# Altium schematic sheet 24V Regulators.SchDoc
size A3
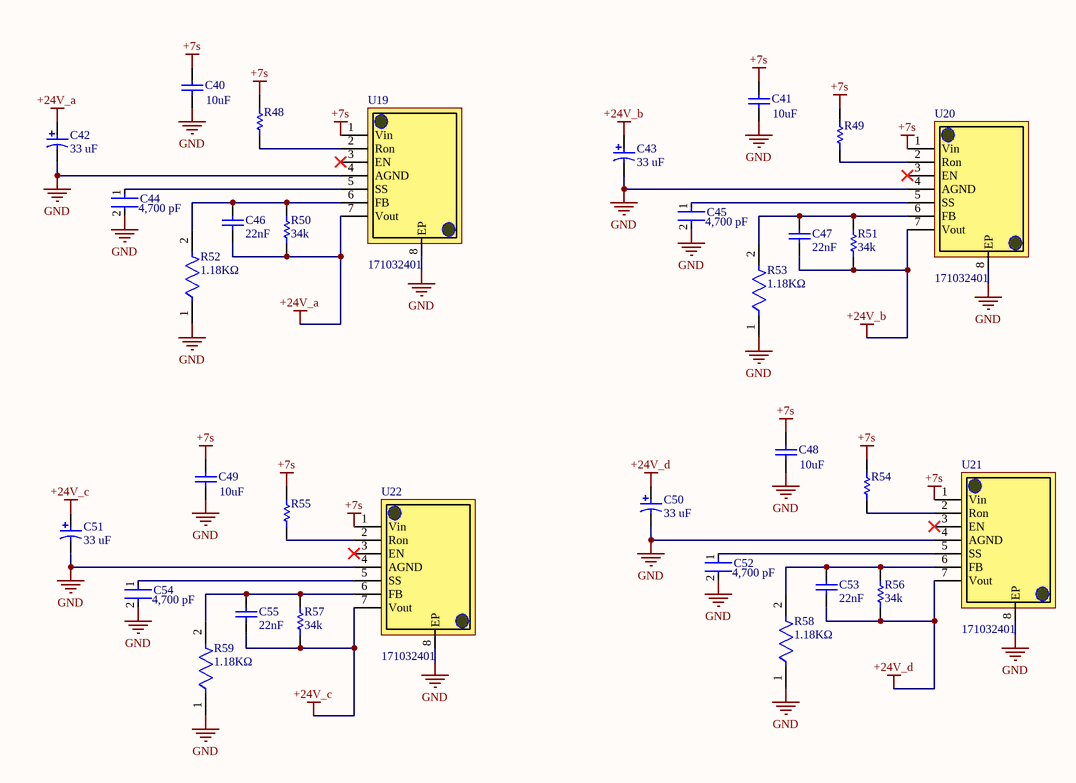
[diagram p0: 24V Regulators.SchDoc]

## Parts
C40  value 10uF  [C1206]  (hidden comment: Cap Semi)
C41  value 10uF  [C1206]  (hidden comment: Cap Semi)
C42  Rated Capacitance: 33 uF  [NIC-CAPA2-6.3X5.8_V]  (hidden comment: UUD1V330MCL1GS)
C43  Rated Capacitance: 33 uF  [NIC-CAPA2-6.3X5.8_V]  (hidden comment: UUD1V330MCL1GS)
C44  Capacitance: 4,700 pF  [FP-C0805C-DN-MFG]  (hidden comment: C0805C472K5RACTU)
C45  Capacitance: 4,700 pF  [FP-C0805C-DN-MFG]  (hidden comment: C0805C472K5RACTU)
C46  22nF  [CAPC2013X145X50NL20T25]
C47  22nF  [CAPC2013X145X50NL20T25]
C48  value 10uF  [C1206]  (hidden comment: Cap Semi)
C49  value 10uF  [C1206]  (hidden comment: Cap Semi)
C50  Rated Capacitance: 33 uF  [NIC-CAPA2-6.3X5.8_V]  (hidden comment: UUD1V330MCL1GS)
C51  Rated Capacitance: 33 uF  [NIC-CAPA2-6.3X5.8_V]  (hidden comment: UUD1V330MCL1GS)
C52  Capacitance: 4,700 pF  [FP-C0805C-DN-MFG]  (hidden comment: C0805C472K5RACTU)
C53  22nF  [CAPC2013X145X50NL20T25]
C54  Capacitance: 4,700 pF  [FP-C0805C-DN-MFG]  (hidden comment: C0805C472K5RACTU)
C55  22nF  [CAPC2013X145X50NL20T25]
R48  RC0805FR-07499KL  [RESC2013X60X35LL10T20]  (value not drawn)
R49  RC0805FR-07499KL  [RESC2013X60X35LL10T20]  (value not drawn)
R50  value 34k  [RESC2013X60X40ML20T25]  (hidden comment: ERA6AEB3402V)
R51  value 34k  [RESC2013X60X40ML20T25]  (hidden comment: ERA6AEB3402V)
R52  value 1.18KΩ  [FP-RT0805-MFG]  (hidden comment: RT0805BRE071K18L)
R53  value 1.18KΩ  [FP-RT0805-MFG]  (hidden comment: RT0805BRE071K18L)
R54  RC0805FR-07499KL  [RESC2013X60X35LL10T20]  (value not drawn)
R55  RC0805FR-07499KL  [RESC2013X60X35LL10T20]  (value not drawn)
R56  value 34k  [RESC2013X60X40ML20T25]  (hidden comment: ERA6AEB3402V)
R57  value 34k  [RESC2013X60X40ML20T25]  (hidden comment: ERA6AEB3402V)
R58  value 1.18KΩ  [FP-RT0805-MFG]  (hidden comment: RT0805BRE071K18L)
R59  value 1.18KΩ  [FP-RT0805-MFG]  (hidden comment: RT0805BRE071K18L)
U19  171032401  [7 PIN PFM]
U20  171032401  [7 PIN PFM]
U21  171032401  [7 PIN PFM]
U22  171032401  [7 PIN PFM]

## Nets
+7s: C40.1 C41.1 C48.1 C49.1 R48.1 R49.1 R54.1 R55.1 U19.1(Vin) U20.1(Vin) U21.1(Vin) U22.1(Vin)
+24V_a: C42.1 C46.1 R50.1 U19.7(Vout)
+24V_b: C43.1 C47.1 R51.1 U20.7(Vout)
+24V_c: C51.1 C55.1 R57.1 U22.7(Vout)
+24V_d: C50.1 C53.1 R56.1 U21.7(Vout)
GND: C40.2 C41.2 C42.2 C43.2 C44.2 C45.2 C48.2 C49.2 C50.2 C51.2 C52.2 C54.2 R52.1 R53.1 R58.1 R59.1 U19.4(AGND) U19.8(EP) U20.4(AGND) U20.8(EP) U21.4(AGND) U21.8(EP) U22.4(AGND) U22.8(EP)
NetC44_1: C44.1 U19.5(SS)
NetC45_1: C45.1 U20.5(SS)
NetC46_2: C46.2 R50.2 R52.2 U19.6(FB)
NetC47_2: C47.2 R51.2 R53.2 U20.6(FB)
NetC52_1: C52.1 U21.5(SS)
NetC53_2: C53.2 R56.2 R58.2 U21.6(FB)
NetC54_1: C54.1 U22.5(SS)
NetC55_2: C55.2 R57.2 R59.2 U22.6(FB)
NetR48_2: R48.2 U19.2(Ron)
NetR49_2: R49.2 U20.2(Ron)
NetR54_2: R54.2 U21.2(Ron)
NetR55_2: R55.2 U22.2(Ron)

Not connected (* = marked no-connect by the designer): U19 3(EN)*; U20 3(EN)*; U21 3(EN)*; U22 3(EN)*

## Library data of the parts
C40 C41 C48 C49 = Cap Semi: Capacitor (Semiconductor SIM Model); Published: 8-Jun-2000; LatestRevisionDate: 29-May-2009; LatestRevisionNote: IPC-7351 Footprint Added.; PackageReference: C1206; Publisher: Altium Limited; PackageDescription: Chip Capacitor; Supplier 1: Avnet; Supplier Part Number 1: CL31A106MBHNNNE
C42 C43 C50 C51 = CMP-0687-00044-1: Aluminum Electrolytic Capacitor, UD Series, Low Impedance, 33 uF, 35 V, + / - 20%, -55 to 105 degC, Chip Type, 6.3 x 5.8 mm D x L, Pb-Free, Reel; Manufacturer: Nichicon; Rated Ripple Current (at 100kHz): 230 mA; Endurance Time: 2000 h; Packing: Dia382mm Reel; Tolerance Rated Capacitance: -20 to 20%; Impedance: 0.44 Ohm; Rated Voltage: 35 V; RoHS: TRUE; PackageReference: CAPAE-D6.3H5.8; PartNumber: UUD1V330MCL1GS; ComponentLink3Description: Package Specification; Diameter: 6.3 mm; PackageDescription: 2-Pin Surface Mount Device, Diameter 6.3 mm, Height 5.8 mm, Pitch 5.4 mm; ComponentLink1URL: http://www.nichicon.co.jp/; Length: 5.8 mm; ComponentLink1Description: Manufacturer URL; ComponentLink2URL: http://products.nichicon.co.jp/en/pdf/XJA043/e-ud.pdf; ComponentLink3URL: http://products.nichicon.co.jp/en/pdf/XJA043/e-ud.pdf; ComponentLink2Description: Datasheet; Mounting Technology: Surface Mount; DatasheetVersion: 08/2012
C44 C45 C52 C54 = CMP-03020-025139-1: CAP CER 4700PF 50V X7R 0805; Manufacturer: KEMET; Value: 4,700 pF; Material: Ceramic; Tolerance: 0.1; Temperature Coefficient: 30ppm/°C; Temperature Characteristic: X7R; Manufacturer Part Number: C0805C472K5RACTU; Temperature Range Low: -55°C; Device Class L1: Passive Components; Lead Free: Yes; Category: Cap; ComponentLink2Description: Datasheet; ComponentLink2URL: https://content.kemet.com/datasheets/KEM_C1003_C0G_SMD.pdf; Device Class L3: Ceramic Capacitors; Digikey Description: CAP CER 4700PF 50V X7R 0805; RoHS: TRUE; Temperature Range High: +125°C; Voltage Rating: 50 V; Mouser Description: Cap Ceramic 0.0047uF 50V X7R 10% SMD 0805 125°C Paper T/R; Octopart: https://octopart.com/c0805c472k5ractu-kemet-86501; Automotive: No; Package: C0805C-DN; Height: 0.88mm; Device Class L2: Capacitors; Temperature: -55°C to +125°C; Ipc Land Pattern Name: CAPC200125X78
C46 C47 C53 C55 = CMP-2007-01055-1: Part Number: C0805C223K1RACAUTO; Manufacturer: Kemet
R48 R49 R54 R55 = CMP-2001-01165-1: Manufacturer: Yageo; Part Number: RC0805FR-07499KL
R50 R51 R56 R57 = CMP-2001-00803-1: Manufacturer: Panasonic; Part Number: ERA6AEB3402V
R52 R53 R58 R59 = CMP-03412-010286-1: RES SMD 1.18K OHM 0.1% 1/8W 0805; Manufacturer: Yageo; Temperature Coefficient: 50 ppm/°C; Voltage Rating: 150V; Power Rating: 0.125W; Tolerance: 0.0025; Lead Free: Yes; Manufacturer Part Number: RT0805BRE071K18L; Temperature Range Low: -55°C; Device Class L3: Chip SMD Resistors; RoHS: TRUE; Temperature: -55°C to +155°C; Ipc Land Pattern Name: RESC200125X50; Device Class L2: Resistors; ComponentLink2Description: Datasheet; Automotive: No; Digikey Description: RES SMD 1.18K OHM 0.1% 1/8W 0805; Category: Res; ComponentLink2URL: http://www.yageo.com/documents/recent/PYu-RT_1-to-0.01_RoHS_L_9.pdf; Series: RT; Package: RT0805; Device Class L1: Passive Components; Octopart: https://octopart.com/rt0805bre071k18l-yageo-1175281; Footprint Url: http://www.yageo.com/exep/pages/download/literatures/PYu-R_Mount_10.pdf; Composition: Thin Film; Height: 0.6mm; Resistance: 1.18KΩ; Temperature Range High: +155°C
U19-U22 = CMP-1496-00005-1: MagI³C-VDRM Variable Step Down Regulator Module WE-VDRM , Ui=6-42V; Manufacturer: Wuerth Elektronik; Ui: 6-42 V; ComponentLink1Description: Manufacturer URL; ComponentLink2Description: Datasheet; ComponentLink1URL: http://www.we-online.com; ComponentLink2URL: http://katalog-live.we-online.de/pm/datasheet/171032401.pdf; PartNumber: 171032401; PackageReference: 7 PIN PFM